# Altium schematic sheet MCP1726_PINOUT.SchDoc
size A; SheetNumber: 11; SheetTotal: 12
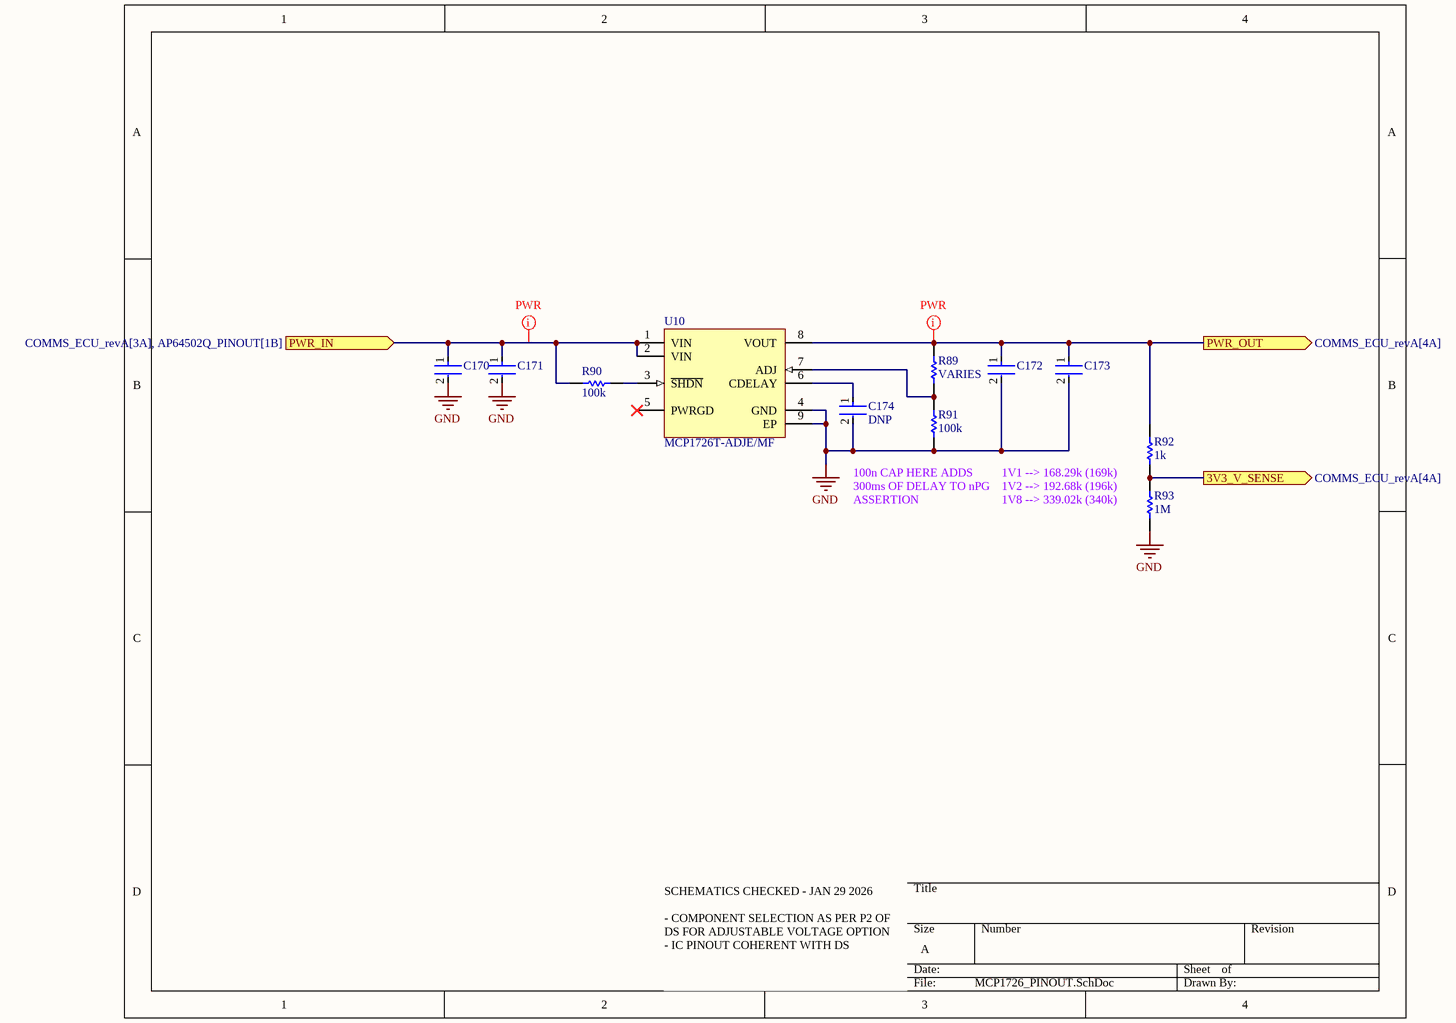
[diagram p0: MCP1726_PINOUT.SchDoc]

## Parts
C170  C0805C475J4RACAUTO  [FP-C0805C475J4RACAUTO-MFG]  (value not drawn)
C171  DNP  [FP-C0805C475J4RACAUTO-MFG]  (value not drawn)
C172  HMK325B7105KN-T  [FP-1210-L_3_2_0_3-W_2_5_0-IPC_B]  (value not drawn)
C173  DNP  [FP-1210-L_3_2_0_3-W_2_5_0-IPC_B]  (value not drawn)
C174  DNP  [FP-0402-L_1_0_0_05-W_0_5-IPC_A]
R89  VARIES  [R0603B]
R90  100k  [R0603B]
R91  100k  [R0603B]
R92  1k  [R0603B]
R93  1M  [R0603B]
U10  MCP1726T-ADJE/MF  [DFN-MF8]

## Ports
3V3_V_SENSE (out, see COMMS_ECU_revA[4A]), PWR_IN (in, see COMMS_ECU_revA[3A], AP64502Q_PINOUT[1B]), PWR_OUT (out, see COMMS_ECU_revA[4A])

## Nets
GND: C170.2 C171.2 C172.2 C173.2 C174.2 R91.1 R93.1 U10.4(GND) U10.9(EP)
3V3_V_SENSE: R92.1 R93.2 ; port 3V3_V_SENSE
PWR_IN: C170.1 C171.1 R90.1 U10.1(VIN) U10.2(VIN) ; port PWR_IN
PWR_OUT: C172.1 C173.1 R89.2 R92.2 U10.8(VOUT) ; port PWR_OUT
NetC174_1: C174.1 U10.6(CDELAY)
NetR89_1: R89.1 R91.2 U10.7(ADJ)
NetR90_2: R90.2 U10.3(~{SHDN})

Not connected (* = marked no-connect by the designer): U10 5(PWRGD)*

## Layout directives
net class PWR: PWR_IN, PWR_OUT

## Notes on the sheet
- (near R91) 100n CAP HERE ADDS 300ms OF DELAY TO nPG ASSERTION
- 1V1 --> 168.29k (169k)
  1V2 --> 192.68k (196k)
  1V8 --> 339.02k (340k)
- SCHEMATICS CHECKED - JAN 29 2026
  - COMPONENT SELECTION AS PER P2 OF DS FOR ADJUSTABLE VOLTAGE OPTION
  - IC PINOUT COHERENT WITH DS

## Library data of the parts
C170 C171 = CMP-00212-84766729-1: C0805C475J4RACAUTO Cap Ceramic 4.7uF 16V X7R 5% Pad SMD 0805 125C Automotive T/R; Capacitance: 4.7µF; Max Operating Temperature: 125°C; Dielectric Material: Ceramic; Voltage Rating (DC): 16V; Dielectric: X7R; Height: 1.4mm; Case/Package: 0805; NexarPartId: 84766729; Voltage Rating: 16V; RoHS: Compliant; Material: Ceramic; Packaging: Cut Tape; Tolerance: 5%; Min Operating Temperature: -55°C
C172 C173 = CMP-14477-002774-2: None; Dielectric: X5R; Capacitance: 1uF; Voltage Rating (DC): 100V; Tolerance: 10%; Length: 3.2mm; Thickness: 0.083inch; Construction: Flat; Width: 2.5mm; Number of Pins: 2; Height: 1.9mm; REACH SVHC: No SVHC; Case Code (Metric): 3225; Termination: SMD/SMT; Packaging: Tape and Reel; Resistor Type: Ceramic; Mount: Surface Mount; Radiation Hardening: No; Case/Package: 1210; Case Code (Imperial): 1210; Min Operating Temperature: -55°C; Max Operating Temperature: 125°C; Halogen Free: Halogen Free; Voltage Rating: 100V; Depth: 2.5mm; Package Quantity: 1; RoHS Compliant: Yes; Voltage: 100V; Series: M
C174 = CMP-001-00058-1: LARGE PADS, 0402 CAP, CHANGE COMMENT TO MATCH REAL P/N; Capacitor Type: Ceramic; Min Operating Temperature: -55°C; Mounting Technology: Surface Mount; Pins: 2; Case/Package: 0402; RoHS Compliant: Yes; Max Operating Temperature: 85°C
R89 R90 R92 R93 = CMP-009-00002-14: Resistor
  R89: Value: VARIES
  R90: Value: 100k
  R92: Value: 1k
  R93: Value: 1M
R91 = CMP-009-00002-14: Resistor; Value: 10k
U10 = CMP-0136-00358-1: 1A, Low Voltage, Low Quiescent Current LDO Regulator, 8-Pin DFN, Extended Temperature, Tape and Reel; DatasheetVersion: revC, Aug-2007; PackageDescription: 8-Lead Plastic Dual Flat, No Lead Package (MF) - 3x3x0.9mm Body [DFN]; PackageVersion: revBB, Aug-2009; PackageReference: DFN-MF8